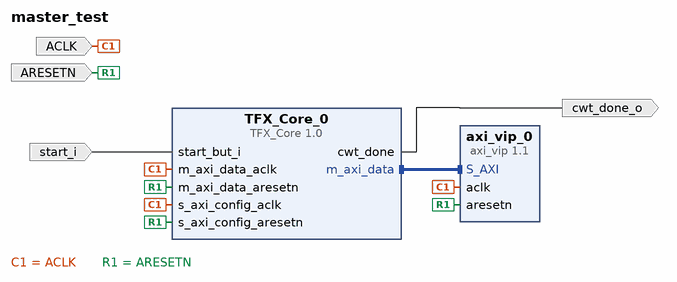
[diagram p0: block diagram of the top level]
# Vivado block design master_test, xc7z010clg400-1, Vivado 2021.1
create_bd_design master_test

create_bd_port -dir I start_i
create_bd_port -dir I -type clk ACLK
create_bd_port -dir I -type rst ARESETN
create_bd_port -dir O cwt_done_o

create_bd_cell -type ip -vlnv xilinx.com:ip:axi_vip:1.1 axi_vip_0
set_property -dict {CONFIG.INTERFACE_MODE SLAVE} [get_bd_cells axi_vip_0]
create_bd_cell -type ip -vlnv user.org:user:TFX_Core:1.0 TFX_Core_0
set_property -dict {CONFIG.C_M_AXI_Data_BURST_LEN 256} [get_bd_cells TFX_Core_0]

# ---- connections ----

connect_bd_intf_net [get_bd_intf_pins TFX_Core_0/m_axi_data] [get_bd_intf_pins axi_vip_0/S_AXI]
connect_bd_net [get_bd_pins TFX_Core_0/cwt_done] [get_bd_ports cwt_done_o]
connect_bd_net -net m_axi_data_aclk_0_1 [get_bd_ports ACLK] \
  [get_bd_pins axi_vip_0/aclk] [get_bd_pins TFX_Core_0/s_axi_config_aclk] [get_bd_pins TFX_Core_0/m_axi_data_aclk]
connect_bd_net -net s_axi_config_aresetn_0_1 [get_bd_ports ARESETN] \
  [get_bd_pins axi_vip_0/aresetn] [get_bd_pins TFX_Core_0/s_axi_config_aresetn] [get_bd_pins TFX_Core_0/m_axi_data_aresetn]
connect_bd_net -net start_i_0_1 [get_bd_ports start_i] [get_bd_pins TFX_Core_0/start_but_i]

validate_bd_design
save_bd_design
